# Altium project Inverter_Power.PrjPcb (part 1 of 3)
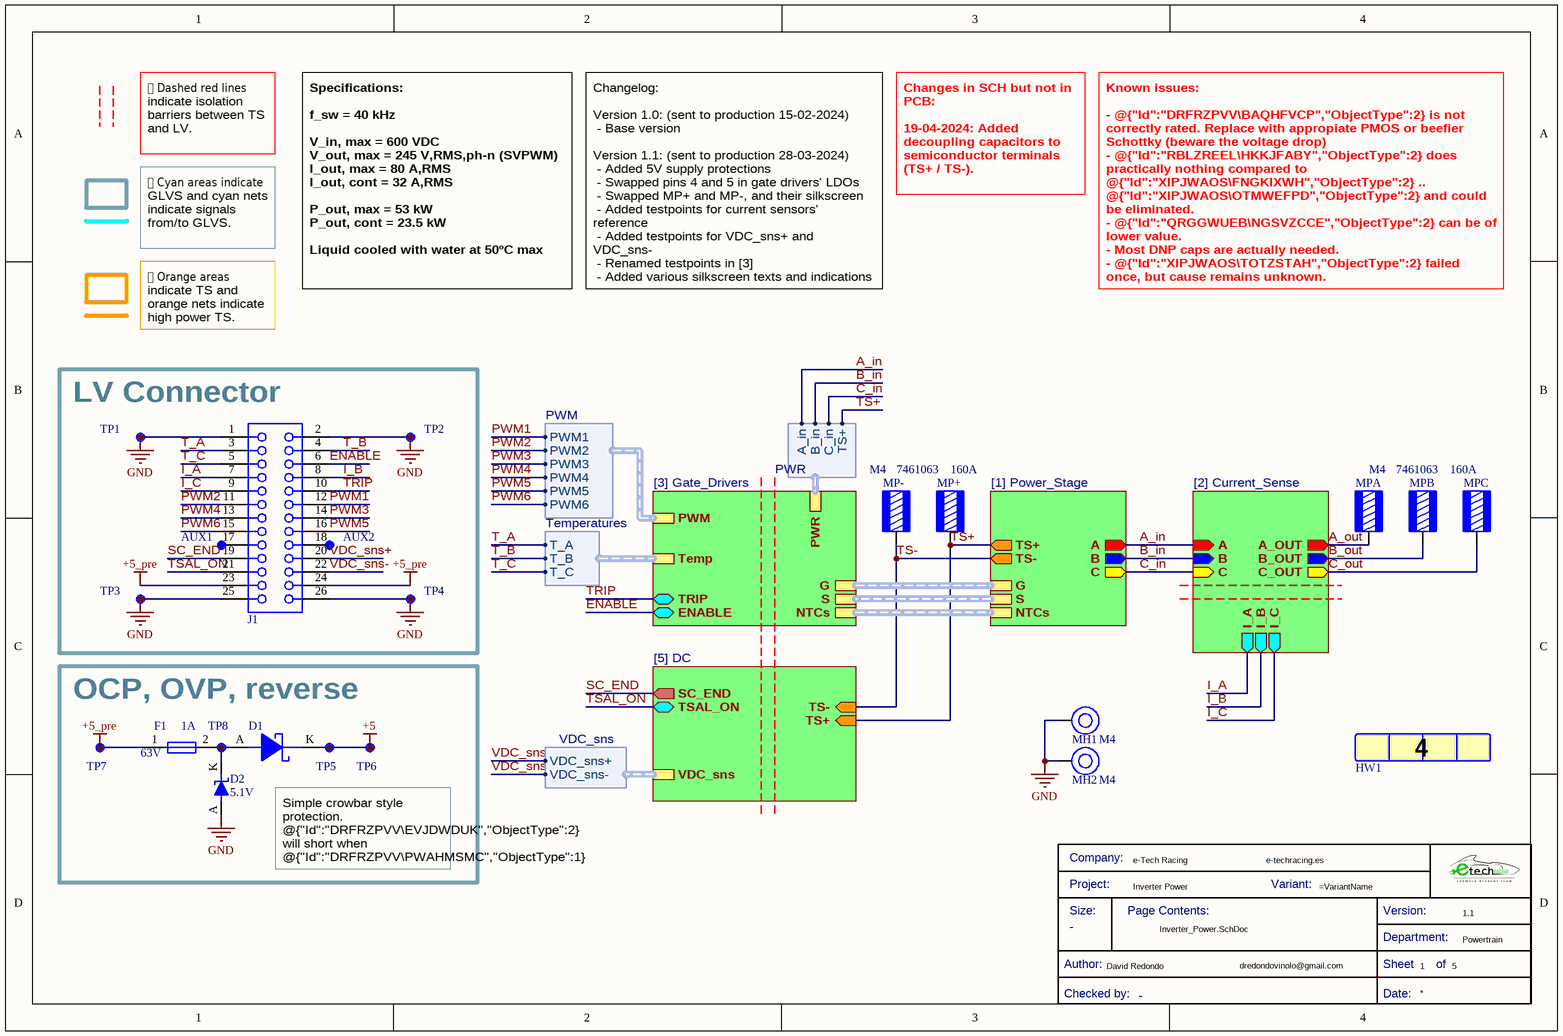
[diagram p0: Inverter_Power.SchDoc]
Company: e-Tech Racing; Department: Powertrain; DesignedByURL: e-techracing.es; DesignerMail: dredondovinolo@gmail.com; DesignerName: David Redondo; Project: Inverter Power; ReviewerName: -; Version: 1.1
6 sheets, 317 parts. Net scope: hierarchical (ports join the sheet entries above them; power ports are global).
Board file: Inverter_Power.PcbDoc
Sheets:
  Inverter_Power.SchDoc
    Power_Stage = [1] Power_Stage.SchDoc
    Current_Sense = [2] Current_Sense.SchDoc
    Gate_Drivers = [3] Gate_Drivers.SchDoc
      A = [4] Half_Bridge.SchDoc
      B = [4] Half_Bridge.SchDoc
      C = [4] Half_Bridge.SchDoc
    DC = [5] DC.SchDoc

## Sheet Inverter_Power.SchDoc
size A4; SheetNumber: 1; SheetTotal: 5

### Parts
*  Title Block_template  (value not drawn)  (graphical)
AUX1  TestPoint  [TestPoint]  (value not drawn)  (no BOM)
AUX2  TestPoint  [TestPoint]  (value not drawn)  (no BOM)
D1  MBR0530  [DSC-SOD123]  (value not drawn)
D2  Reference Voltage-Nom: 5.1V  [DZ-6.2V-DO-214AC]  (hidden comment: BZG05C5V1-E3-TR)
F1  Current Rating: 1A  Voltage Rating (DC): 63V  [Fuse_1206]  (hidden comment: 0437001.WRA)
HW1  LOGO CAPAS (4)  [LOGO_LAYERS_4]  (value not drawn)
J1  613026243121  [613026243121]  (value not drawn)
MH1  Mounting_Hole_M4  [Mounting_Hole_M4]  (value not drawn)
MH2  Mounting_Hole_M4  [Mounting_Hole_M4]  (value not drawn)
MP+  M4  [7461063_HAL]  (value not drawn)
MP-  Rated Current: 160A  [7461063_HAL]  (hidden comment: M4)
MPA  M4  [7461063_HAL]  (value not drawn)
MPB  Rated Current: 160A  [7461063_HAL]  (hidden comment: M4)
MPC  M4  [7461063_HAL]  (value not drawn)
TP1  TestPoint  [TestPoint]  (value not drawn)  (no BOM)
TP2  TestPoint  [TestPoint]  (value not drawn)  (no BOM)
TP3  TestPoint  [TestPoint]  (value not drawn)  (no BOM)
TP4  TestPoint  [TestPoint]  (value not drawn)  (no BOM)
TP5  TestPoint  [TestPoint]  (value not drawn)  (no BOM)
TP6  TestPoint  [TestPoint]  (value not drawn)  (no BOM)
TP7  TestPoint  [TestPoint]  (value not drawn)  (no BOM)
TP8  TestPoint  [TestPoint]  (value not drawn)  (no BOM)

### Blocks framed on the sheet
LV Connector: AUX1 AUX2 J1 TP1-TP4
OCP, OVP, reverse: D1 D2 F1 TP5-TP8

### Sub-sheets
Current_Sense = [2] Current_Sense: A (in), B (in), C (in), A_OUT (out), B_OUT (out), C_OUT (out), I_B (out), I_A (out), I_C (out)
DC = [5] DC: TS+ (in), TS- (in), VDC_sns (harness VDC_sns), TSAL_ON (bidir), SC_END (out)
Gate_Drivers = [3] Gate_Drivers: ENABLE (bidir), S (harness S), G (harness G), PWM (harness PWM), NTCs (harness NTCs), Temp (harness Temperatures), TRIP (bidir), PWR (harness PWR)
Power_Stage = [1] Power_Stage: A (out), B (out), C (out), TS+ (out), TS- (out), NTCs (harness NTCs), S (harness S), G (harness G)

### Harnesses
PWM: PWM1, PWM2, PWM3, PWM4, PWM5, PWM6
Temperatures: T_A, T_B, T_C
PWR: A_in, B_in, C_in, TS+
VDC_sns: VDC_sns+, VDC_sns-

### Nets
+5: D1.K TP5.1(TP) TP6.1(TP)
+5_pre: F1.1 J1.23 J1.24 TP7.1(TP)
A_in: sheet Power_Stage/A, sheet Current_Sense/A, sheet Gate_Drivers/PWR.A_in
B_in: sheet Power_Stage/B, sheet Current_Sense/B, sheet Gate_Drivers/PWR.B_in
C_in: sheet Power_Stage/C, sheet Current_Sense/C, sheet Gate_Drivers/PWR.C_in
GND: D2.A J1.1 J1.2 J1.25 J1.26 MH1.1 MH2.1 TP1.1(TP) TP2.1(TP) TP3.1(TP) TP4.1(TP)
TS+: MP+.1 ; sheet Power_Stage/TS+, sheet DC/TS+, sheet Gate_Drivers/PWR.TS+
TS-: MP-.1 ; sheet Power_Stage/TS-, sheet DC/TS-
A_out: MPA.1 ; sheet Current_Sense/A_OUT
B_out: MPB.1 ; sheet Current_Sense/B_OUT
C_out: MPC.1 ; sheet Current_Sense/C_OUT
ENABLE: J1.6 ; sheet Gate_Drivers/ENABLE
I_A: J1.7 ; sheet Current_Sense/I_A
I_B: J1.8 ; sheet Current_Sense/I_B
I_C: J1.9 ; sheet Current_Sense/I_C
PWM1: J1.12 ; sheet Gate_Drivers/PWM.PWM1
PWM2: J1.11 ; sheet Gate_Drivers/PWM.PWM2
PWM3: J1.14 ; sheet Gate_Drivers/PWM.PWM3
PWM4: J1.13 ; sheet Gate_Drivers/PWM.PWM4
PWM5: J1.16 ; sheet Gate_Drivers/PWM.PWM5
PWM6: J1.15 ; sheet Gate_Drivers/PWM.PWM6
SC_END: J1.19 ; sheet DC/SC_END
T_A: J1.3 ; sheet Gate_Drivers/Temp.T_A
T_B: J1.4 ; sheet Gate_Drivers/Temp.T_B
T_C: J1.5 ; sheet Gate_Drivers/Temp.T_C
TRIP: J1.10 ; sheet Gate_Drivers/TRIP
TSAL_ON: J1.21 ; sheet DC/TSAL_ON
VDC_sns+: J1.20 ; sheet DC/VDC_sns.VDC_sns+
VDC_sns-: J1.22 ; sheet DC/VDC_sns.VDC_sns-
NetAUX1_1: AUX1.1(TP) J1.17
NetAUX2_1: AUX2.1(TP) J1.18
NetD1_A: D1.A D2.K F1.2 TP8.1(TP)

### Buses and harness runs
harness sheet Gate_Drivers/G = sheet Power_Stage/G
harness sheet Gate_Drivers/NTCs = sheet Power_Stage/NTCs
harness sheet Gate_Drivers/S = sheet Power_Stage/S

### Notes on the sheet
- ⓘ Dashed red lines indicate isolation barriers between TS and LV.
- ⓘ Cyan areas indicate GLVS and cyan nets indicate signals from/to GLVS.
- Changes in SCH but not in PCB:
  19-04-2024: Added decoupling capacitors to semiconductor terminals (TS+ / TS-).
- Specifications:
  f_sw = 40 kHz
  V_in, max = 600 VDC
  V_out, max = 245 V,RMS,ph-n (SVPWM)
  I_out, max = 80 A,RMS
  I_out, cont = 32 A,RMS
  P_out, max = 53 kW
  P_out, cont = 23.5 kW
  Liquid cooled with water at 50ºC max
- Changelog:
  Version 1.0: (sent to production 15-02-2024)
  - Base version
  Version 1.1: (sent to production 28-03-2024)
  - Added 5V supply protections
  - Swapped pins 4 and 5 in gate drivers' LDOs
  - Swapped MP+ and MP-, and their silkscreen
  - Added testpoints for current sensors' reference
  - Added testpoints for VDC_sns+ and VDC_sns-
  - Renamed testpoints in [3]
  - Added various silkscreen texts and indications
  - Added layer physical logo
- Known issues:
  - @{"Id":"DRFRZPVV\BAQHFVCP","ObjectType":2} is not correctly rated. Replace with appropiate PMOS or beefier Schottky (beware the voltage drop)
  - @{"Id":"RBLZREEL\HKKJFABY","ObjectType":2} does practically nothing compared to @{"Id":"XIPJWAOS\FNGKIXWH","ObjectType":2} .. @{"Id":"XIPJWAOS\OTMWEFPD","ObjectType":2} and could be eliminated.
  - @{"Id":"QRGGWUEB\NGSVZCCE","ObjectType":2} can be of lower value.
  - Most DNP caps are actually needed.
  - @{"Id":"XIPJWAOS\TOTZSTAH","ObjectType":2} failed once, but cause remains unknown.
  - @{"Id":"XIPJWAOS\BERXNCAD","ObjectType":2} should have a bigger value.
  - @{"Id":"XIPJWAOS\TLMWNZGJ","ObjectType":2} and @{"Id":"XIPJWAOS\ETFZDMYQ","ObjectType":2} should have a small tolerance, and it should be specified in the schematic.
  - 10uF 50V 0805 caps are expensive and should be replaced with 10uF 50V 1206 or 10uF 50V 1210.
- ⓘ Orange areas indicate TS and orange nets indicate high power TS.
- M4
- (near MH2) M4
- Simple crowbar style protection. @{"Id":"DRFRZPVV\EVJDWDUK","ObjectType":2} will short when @{"Id":"DRFRZPVV\PWAHMSMC","ObjectType":1} > 5.1V, and it will cause the fuse to blow.
- (in symbol LOGO CAPAS) 4 Layers
- (in symbol Title Block_template) Company:; Project:; Variant:; Size:; Page Contents:; Version:; Department:; Author:; Sheet; of; Checked by:; Date:

### Library data of the parts
* = Title Block_template: Standard Title Block; .Creator: GP; Category: Title Block; .PCBcheck: GP; .SCHcheck: GP; Checked by:: -; Size: -
AUX1 AUX2 TP1-TP8 = TestPoint: Test Point 1x1 mm; .Creator: GP; Category: TestPoint; .PCBcheck: GP; .SCHcheck: GP
D1 = DSC-0.5/30-SOD123: VR=30V IF=500mA 30pF P=410mW; Element Configuration: Single; Forward Voltage: 430mV; Peak Non-Repetitive Surge Current: 5.5A; Average Rectified Current: 500mA; Max Reverse Leakage Current: 130uA; Max Reverse Voltage (DC): 30V; Polarity: Standard; .Creator: GP; Category: Diode; ComponentLink1Description: Datasheet; ComponentLink1URL: *; ComponentLink2Description: Where buy it; ComponentLink2URL: *; Supplier 1: Newark; Stock 1: 9; Pricing 1: 1=0,34400, 10=0,23900, 100=0,12200, 500=0,10000 (USD); Mount: Surface Mount; Contact Plating: Tin,Matte; Weight: 0.03g; Package Quantity: 1; Max Surge Current: 5.5A; Forward Current: 500mA; Max Reverse Current: 130uA; Max Repetitive Reverse Voltage (Vrrm): 30V; Max Forward Surge Current (Ifsm): 5.5A; Voltage Rating (DC): 30V; Current Rating: 500mA; Output Current: 500mA; Series: -; Length: 2.7mm; Width: 1.6mm; Height: 1.03mm; Radiation Hardening: No; RoHS Compliant: Yes; REACH SVHC: No SVHC; Lead Free: Lead Free; ComponentLink3URL: https://datasheet.ciiva.com/30479/0900766b810e2512-30479401.pdf?src-supplier=RSComponents; ComponentLink3Description: https://datasheet.ciiva.com/30479/0900766b810e2512-30479401.pdf?src-supplier=RSComponents; ComponentLink4URL: https://datasheet.ciiva.com/34301/974753-34301826.pdf?src-supplier=Jameco; ComponentLink4Description: https://datasheet.ciiva.com/34301/974753-34301826.pdf?src-supplier=Jameco; ComponentLink5URL: https://datasheet.ciiva.com/910/mbr0530-910516.pdf?src-supplier=Digi-Key; ComponentLink5Description: https://datasheet.ciiva.com/910/mbr0530-910516.pdf?src-supplier=Digi-Key; ComponentLink6URL: https://datasheet.ciiva.com/25931/mbr0530-25931989.pdf?src-supplier=Avnet+Europe; ComponentLink6Description: https://datasheet.ciiva.com/25931/mbr0530-25931989.pdf?src-supplier=Avnet+Europe; ComponentLink7URL: https://datasheet.ciiva.com/8300/mbr0530-8300905.pdf?src-supplier=Avnet; ComponentLink7Description: https://datasheet.ciiva.com/8300/mbr0530-8300905.pdf?src-supplier=Avnet; ComponentLink8URL: https://datasheet.ciiva.com/17318/mbr0530-17318568.pdf?src-supplier=Future+Electronics; ComponentLink8Description: https://datasheet.ciiva.com/17318/mbr0530-17318568.pdf?src-supplier=Future+Electronics; ComponentLink9URL: https://datasheet.ciiva.com/15144/getdatasheetpartid-86760-15144598.pdf?src-supplier=Verical; ComponentLink9Description: https://datasheet.ciiva.com/15144/getdatasheetpartid-86760-15144598.pdf?src-supplier=Verical; ComponentLink10URL: https://datasheet.ciiva.com/910/mbr0530-910518.pdf?src-supplier=Digi-Key; ComponentLink10Description: https://datasheet.ciiva.com/910/mbr0530-910518.pdf?src-supplier=Digi-Key; Supplier Part Number 1: 15R3453
D2 = DZ-5.1V-DO-214AC: Zener Diode, 5.1V V(Z), 5.88%, 1.25W, Silicon, Unidirectional, DO-214AC; Manufacturer: Vishay; Manufacturer Part Number: BZG05C5V1-M3-08; Package Body Material: Plastic; Additional Feature: HIGH RELIABILITY; Number of Elements: 1; Test Current: 45mA; Time @ Peak Reflow Temperature-Max (s): 30s; Supplier: Mouser; Supplier Part Number: 78-BZG05C5V1-M3-08; RoHS: Yes; Category: Zener Diodes; Stock: 28077; Pricing: 1=0,38, 10=0,3, 50=0,3, 100=0,179, 1000=0,113, 10000=0,089 (USD); Pins: 2; Diode Element Material: SILICON; Package Shape: Rectangular; Terminal Finish: Tin; Max Operating Temperature: 150°C; JESD-609 Code: e3; Polarity: Unidirectional; Diode Type: ZENER; JESD-30 Code: R-PDSO-C2; Moisture Sensitivity Level: 1; Package Style: SMALL OUTLINEMeter; Peak Reflow Temperature (Cel): 260°C; Max Power Dissipation: 1.25W; Surface Mount: Yes; Technology: ZENER; Terminal Form: C BEND; Terminal Position: DUAL; Voltage Tol-Max: 5.88%; JEDEC-95 Code: DO-214AC; RoHS Compliant: Yes; Reach SVHC Compliant: No; ComponentLink1URL: https://datasheet.ciiva.com:443/pdfs/VipMasterIC/IC/VISH/VISH-S-A0008998108/VISH-S-A0008998108-1.pdf?src-supplier=IHS+Markit; ComponentLink1Description: https://datasheet.ciiva.com:443/pdfs/VipMasterIC/IC/VISH/VISH-S-A0008998108/VISH-S-A0008998108-1.pdf?src-supplier=IHS+Markit; ComponentLink2URL: http://www.vishay.com/docs/86135/bzg05c-m-series.pdf?src-supplier=Digikey; ComponentLink2Description: http://www.vishay.com/docs/86135/bzg05c-m-series.pdf?src-supplier=Digikey
F1 = Fuse_1A_63V_1206: Fuse Chip Fast Acting 1A 63V SMD Solder Pad 1206 Ceramic T/R Automotive; Manufacturer: Littelfuse; Fuse Type: Board Mount (Cartridge Style Excluded); Approvals: CSA,cURus; .Creator: DO; Supplier 1: Digi-Key; Manufacturer Part Number: 0437001.WRA; RoHS: Yes; Category: Fuses; Stock 1: 5820; Pricing 1: 1=1,52000, 5=1,47000, 10=1,37600, 50=1,13860, 100=0,94880, 250=0,92508, 500=0,78276, 1000=0,68788 (USD); Mount: Surface Mount; Case/Package: 1206; Case Code (Imperial): 1206; Case Code (Metric): 3216; Min Operating Temperature: -55°C; Max Operating Temperature: 150°C; Packaging: Tape and Reel; Voltage Rating (AC): 63V; ComponentLink1URL: https://www.littelfuse.com/~/media/electronics/datasheets/fuses/littelfuse_fuse_437a_datasheet.pdf.pdf?src-supplier=Digi-Key; ComponentLink1Description: https://www.littelfuse.com/~/media/electronics/datasheets/fuses/littelfuse_fuse_437a_datasheet.pdf.pdf?src-supplier=Digi-Key; Supplier Part Number 1: F10001CT-ND; ComponentLink2Description: Where buy it; ComponentLink2URL: https://www.mouser.es/ProductDetail/Littelfuse/0437001WRA?qs=DXv0QSHKF4z9CJhPXjxR%252BA%3D%3D
HW1 = LOGO CAPAS: Logo 4 capas; Id: 0074; Observations: Layers; Checked: False; Type: Logos; Supplier 1: Farnell; Supplier 2: Mouser; Supplier 3: RS; Supplier 4: Digi-Key; Author: Enric; Date: 22/06/2012
J1 = 613026243121: WR-PHD Socket Header, THT, Angled, pitch 2.54mm, 2 Row, 26P; Manufacturer: Wurth Elektronik; Contact Resistance: 20mΩ; Rated Current: 3A; Working Voltage: 250V; Withstanding Voltage: 500V; ComponentLink1Description: Website Link; ComponentLink1URL: https://www.we-online.com/redexpert/article/613026243121?ad; ComponentLink2Description: Datasheet Link; ComponentLink2URL: https://www.we-online.com/redexpert/spec/613026243121?ad; Manufacturer Part Number: 613026243121; Category: Board-to-Board Connectors; Match Code: WR-PHD; Mount: Through Hole; Operating Temperature Max: 125°C; Operating Temperature Min: -40°C; Packaging: Tray; Gender: Socket Header; Number of Pins: 26; Number of Rows: 2; Orientation: Angled; Pitch: 2.54mm
MP+ MP- MPA MPB MPC = 7461063: WP-RATR REDCUBE PRESS-FIT right angled, two-rows, L9W9H14mm, M4, 160A; Manufacturer: Wurth Elektronik; Surface: Tin; ComponentLink1Description: Website Link; ComponentLink1URL: https://www.we-online.com/redexpert/article/7461063?ad; ComponentLink2Description: Datasheet Link; ComponentLink2URL: https://www.we-online.com/redexpert/spec/7461063?ad; Manufacturer Part Number: 7461063; Category: REDCUBE PRESS-FIT; Match Code: WP-RATR; Mount: Press Fit; Operating Temperature Max: 150°C; Operating Temperature Min: -55°C; Packaging: Bulk; Length: 9mm; Width: 9mm; Height: 14mm; Material: Brass; Number of Pins: 8; Thread Size: M4
  MP+ MPA MPC: Rated Current: 160A

## Sheet [1] Power_Stage.SchDoc
size A4; SheetNumber: 2; SheetTotal: 5
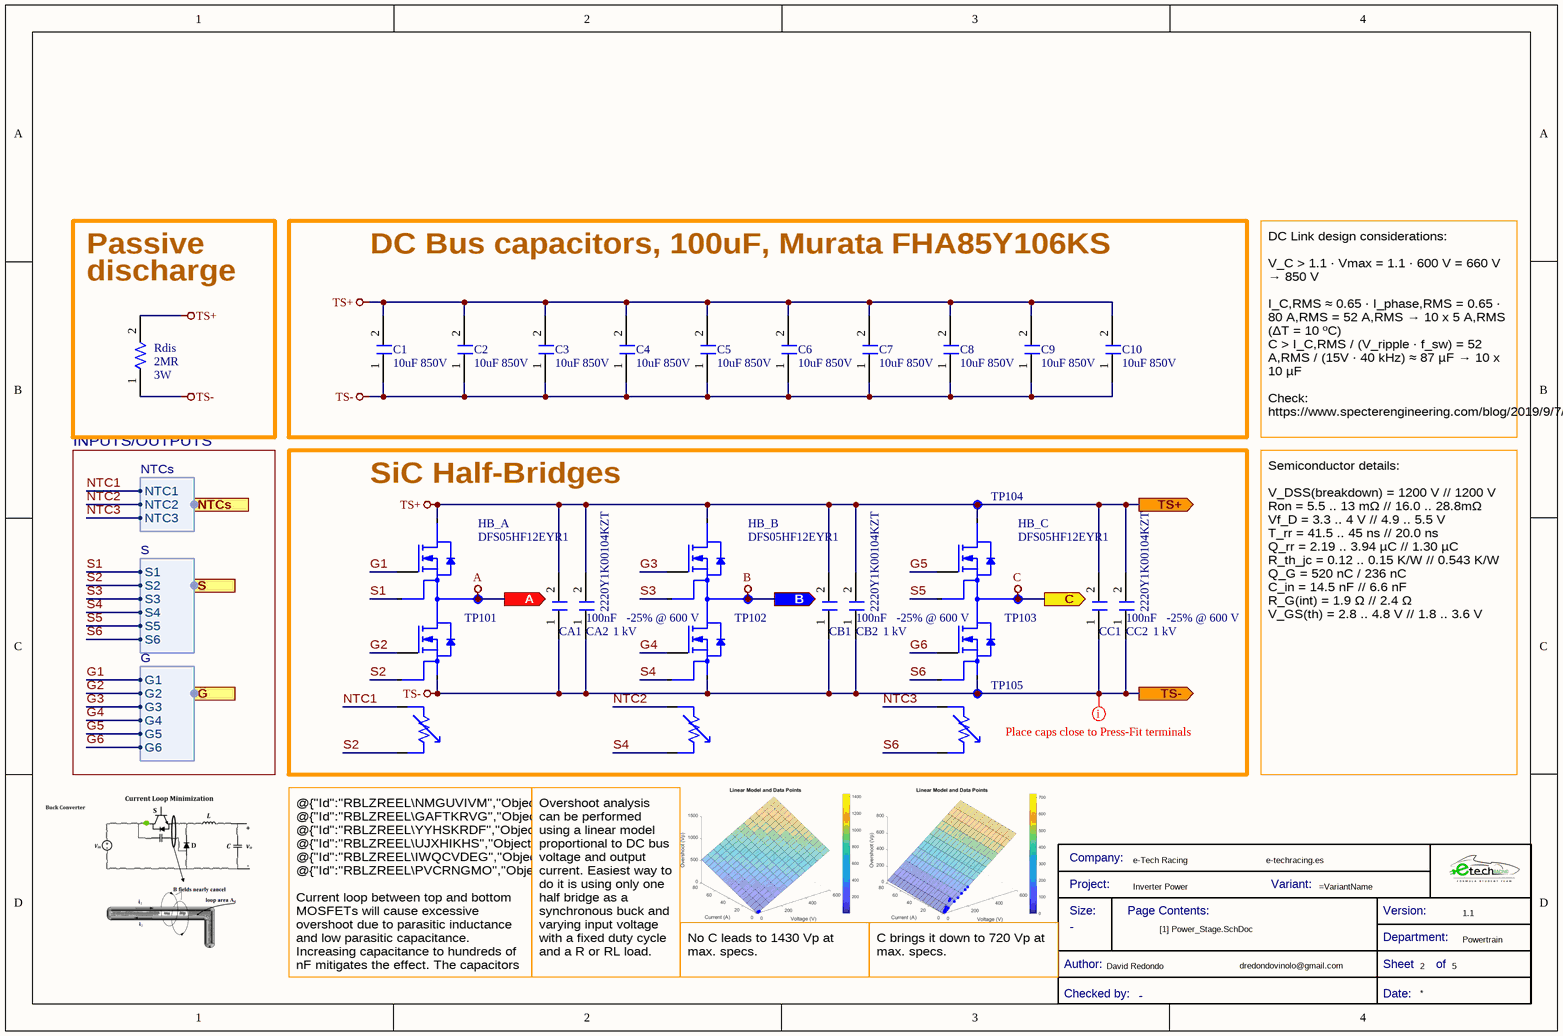
[diagram p1: [1] Power_Stage.SchDoc]

### Parts
(Parts that share a designator on the sheet are numbered #1, #2 ... from top to bottom, then left to right.)
*?#1  Title Block_template  (value not drawn)  (graphical)
C1  10uF 850V  [FHA85Y106KS]
C2  10uF 850V  [FHA85Y106KS]
C3  10uF 850V  [FHA85Y106KS]
C4  10uF 850V  [FHA85Y106KS]
C5  10uF 850V  [FHA85Y106KS]
C6  10uF 850V  [FHA85Y106KS]
C7  10uF 850V  [FHA85Y106KS]
C8  10uF 850V  [FHA85Y106KS]
C9  10uF 850V  [FHA85Y106KS]
C10  10uF 850V  [FHA85Y106KS]
CA1  2220Y1K00104KZT  [CAP_2220]  (value not drawn)
CA2  2220Y1K00104KZT  value 100nF  DC bias: -25% @ 600 V  Voltage rating: 1 kV  [CAP_2220]
CB1  2220Y1K00104KZT  [CAP_2220]  (value not drawn)
CB2  2220Y1K00104KZT  value 100nF  DC bias: -25% @ 600 V  Voltage rating: 1 kV  [CAP_2220]
CC1  2220Y1K00104KZT  [CAP_2220]  (value not drawn)
CC2  2220Y1K00104KZT  value 100nF  DC bias: -25% @ 600 V  Voltage rating: 1 kV  [CAP_2220]
HB_A  DFS05HF12EYR1  [DFS05HF12EYR1]
HB_B  DFS05HF12EYR1  [DFS05HF12EYR1]
HB_C  DFS05HF12EYR1  [DFS05HF12EYR1]
Rdis  Power Rating: 3W  Resistance: 2MR  [R2512FTK]  (hidden comment: R2M-2512FTK)
TP101  TestPoint  [TestPoint]  (value not drawn)  (no BOM)
TP102  TestPoint  [TestPoint]  (value not drawn)  (no BOM)
TP103  TestPoint  [TestPoint]  (value not drawn)  (no BOM)
TP104  TestPoint  [TestPoint]  (value not drawn)  (no BOM)
TP105  TestPoint  [TestPoint]  (value not drawn)  (no BOM)

### Blocks framed on the sheet
DC Bus capacitors, 100uF, Murata FHA85Y106KS: C1-C10
SiC Half-Bridges: CA1 CA2 CB1 CB2 CC1 CC2 HB_A HB_B HB_C TP101-TP105

### Ports
A (out, see Inverter_Power[3C], [2] Current_Sense[2A]), B (out, see Inverter_Power[3C], [2] Current_Sense[2B]), C (out, see Inverter_Power[3C], [2] Current_Sense[2C]), G (harness G, see Inverter_Power[3C], [3] Gate_Drivers[3A]), NTCs (harness NTCs, see Inverter_Power[3C], [3] Gate_Drivers[4A]), S (harness S, see Inverter_Power[3C], [3] Gate_Drivers[3A]), TS+ (out, see Inverter_Power[3C], [4] Half_Bridge[3A], [5] DC[1D]), TS- (out, see Inverter_Power[3C], [5] DC[1D])

### Harnesses
NTCs: NTC1, NTC2, NTC3
S: S1, S2, S3, S4, S5, S6
G: G1, G2, G3, G4, G5, G6

### Nets
A: HB_A.1(AC) TP101.1(TP) ; port A  [project net A_in]
B: HB_B.1(AC) TP102.1(TP) ; port B  [project net B_in]
C: HB_C.1(AC) TP103.1(TP) ; port C  [project net C_in]
TS+: C1.2 C2.2 C3.2 C4.2 C5.2 C6.2 C7.2 C8.2 C9.2 C10.2 CA1.2 CA2.2 CB1.2 CB2.2 CC1.2 CC2.2 HB_A.4(DC+) HB_B.4(DC+) HB_C.4(DC+) Rdis.2 TP104.1(TP) ; port TS+
TS-: C1.1 C2.1 C3.1 C4.1 C5.1 C6.1 C7.1 C8.1 C9.1 C10.1 CA1.1 CA2.1 CB1.1 CB2.1 CC1.1 CC2.1 HB_A.5(DC-) HB_B.5(DC-) HB_C.5(DC-) Rdis.1 TP105.1(TP) ; port TS-
G1: HB_A.6(G1) ; port G.G1
G2: HB_A.3(G2) ; port G.G2
G3: HB_B.6(G1) ; port G.G3
G4: HB_B.3(G2) ; port G.G4
G5: HB_C.6(G1) ; port G.G5
G6: HB_C.3(G2) ; port G.G6
NTC1: HB_A.9(T2) ; port NTCs.NTC1
NTC2: HB_B.9(T2) ; port NTCs.NTC2
NTC3: HB_C.9(T2) ; port NTCs.NTC3
S1: HB_A.7(S1) ; port S.S1
S2: HB_A.2(S2) HB_A.8(T1) ; port S.S2
S3: HB_B.7(S1) ; port S.S3
S4: HB_B.2(S2) HB_B.8(T1) ; port S.S4
S5: HB_C.7(S1) ; port S.S5
S6: HB_C.2(S2) HB_C.8(T1) ; port S.S6

### Layout directives
mark named Place caps close to Press-Fit terminals: TS-

### Notes on the sheet
- Passive
- discharge
- INPUTS/OUTPUTS
- DC Link design considerations:
  V_C > 1.1 · Vmax = 1.1 · 600 V = 660 V → 850 V
  I_C,RMS ≈ 0.65 · I_phase,RMS = 0.65 · 80 A,RMS = 52 A,RMS → 10 x 5 A,RMS (ΔT = 10 ºC)
  C > I_C,RMS / (V_ripple · f_sw) = 52 A,RMS / (15V · 40 kHz) ≈ 87 µF → 10 x 10 µF
  Check: https://www.specterengineering.com/blog/2019/9/7/dc-link-capacitor-selection-for-your-inverter
- Semiconductor details:
  V_DSS(breakdown) = 1200 V // 1200 V
  Ron = 5.5 .. 13 mΩ // 16.0 .. 28.8mΩ
  Vf_D = 3.3 .. 4 V // 4.9 .. 5.5 V
  T_rr = 41.5 .. 45 ns // 20.0 ns
  Q_rr = 2.19 .. 3.94 µC // 1.30 µC
  R_th_jc = 0.12 .. 0.15 K/W // 0.543 K/W
  Q_G = 520 nC / 236 nC
  C_in = 14.5 nF // 6.6 nF
  R_G(int) = 1.9 Ω // 2.4 Ω
  V_GS(th) = 2.8 .. 4.8 V // 1.8 .. 3.6 V
- (near HB_A) @{"Id":"RBLZREEL\NMGUVIVM","ObjectType":2}, @{"Id":"RBLZREEL\GAFTKRVG","ObjectType":2}, @{"Id":"RBLZREEL\YYHSKRDF","ObjectType":2}, @{"Id":"RBLZREEL\UJXHIKHS","ObjectType":2}, @{"Id":"RBLZREEL\IWQCVDEG","ObjectType":2}, @{"Id":"RBLZREEL\PVCRNGMO","ObjectType":2}
  Current loop between top and bottom MOSFETs will cause excessive overshoot due to parasitic inductance and low parasitic capacitance. Increasing capacitance to hundreds of nF mitigates the effect. The capacitors essentially work as a switching decoupling. MLCCs with low DC bias or film, but MLCCs are way more compact. Place as close as possible to semiconductor terminals.
- (near HB_B) Overshoot analysis can be performed using a linear model proportional to DC bus voltage and output current. Easiest way to do it is using only one half bridge as a synchronous buck and varying input voltage with a fixed duty cycle and a R or RL load.
- No C leads to 1430 Vp at max. specs.
- (near *?#1) C brings it down to 720 Vp at max. specs.
- (in symbol Title Block_template) Company:; Project:; Variant:; Size:; Page Contents:; Version:; Department:; Author:; Sheet; of; Checked by:; Date:

### Library data of the parts
*?#1 = Title Block_template: Standard Title Block; .Creator: GP; Category: Title Block; .PCBcheck: GP; .SCHcheck: GP; Checked by:: -; Size: -
C1-C10 = FHA85Y106KS: High Temperature Film Capacitor for Automotive Application
CA1 CB1 CC1 = 2220Y1K00104KZT: 100NF 2220 Case Size 1000V Ceram; Manufacturer: Knowles Syfer; DC bias: -25% @ 600 V; Voltage rating: 1 kV; Footprint: 2220; Supplier: Digikey; Supplier Part Number: 1608-2220Y1K00104KZTCT-ND; RoHS: No; Category: Ceramic Capacitors; Stock: 650; Pricing: 1=5,53, 10=4,753, 50=4,3112, 100=3,5595 (USD); Manufacturer Part Number: 2220Y1K00104KZT; Value: 100nF
CA2 CB2 CC2 = 2220Y1K00104KZT: 100NF 2220 Case Size 1000V Ceram; Manufacturer: Knowles Syfer; Footprint: 2220; Supplier: Digikey; Supplier Part Number: 1608-2220Y1K00104KZTCT-ND; RoHS: No; Category: Ceramic Capacitors; Stock: 650; Pricing: 1=5,53, 10=4,753, 50=4,3112, 100=3,5595 (USD); Manufacturer Part Number: 2220Y1K00104KZT
HB_A HB_B HB_C = DFS05HF12EYR1: 1200V/5.5mΩ Half Bridge SiC MOSFET Module; Blocking voltage: 1200 V; Rds(on): 5.5 mOhm .. 13 mOhm; Maximum junction temperature: 175 °C; Isolation voltage: 3.4 kV; Maximum VGSS: +21 V / -2 V; Maximum IDS-ISD: 150 A; NTC resistance @25 ºC: 5 kOhm; NTC B-value @50 ºC: 3375 K; VGS(th): 2.8 V .. 4.8 V; QG: 520 nC; RGint: 1.9 Ohm; Rth(j-c): 0.12 K/W; Vf_diode: 3.3 V .. 4.0 V; ComponentLink1Description: Datasheet; ComponentLink1URL: https://www.leapers-power.com/action/download?file=/web/uploads/file/20230309/E66B0Y1w3x716fyKzgl84X9Kg38sCV40.pdf
Rdis = R2M-2512FTK: Current Sense Resistors - SMD 3watts .002ohms 1%; Manufacturer: Vishay Dale; Manufacturer Part Number: WSLP25122L000FEA; Temperature Coefficient: 275ppm/°C; Supplier 1: Mouser; RoHS: Yes; Category: Chip SMD Resistors; Stock 1: 11994; Pricing 1: 1=1,07000, 10=1,07000, 50=1,07000, 100=1,07000, 1000=0,77100, 10000=0,75500 (USD); Mount: Surface Mount; Case/Package: 2512; Case Code (Imperial): 2512; Case Code (Metric): 6432; Weight: 0.001429oz; Size Code: 2512; Min Operating Temperature: -65°C; Max Operating Temperature: 170°C; Tolerance: 1%; Packaging: Tape and Reel; Resistor Type: Metal Strip; Package Quantity: 2000; Termination: SMD/SMT; Series: WSLP; Length: 6.4mm; Width: 3.2mm; Height: 0.635mm; RoHS Compliant: Yes; Lead Free: Lead Free; ComponentLink1URL: https://datasheet.ciiva.com/48527/wslp-48527354.pdf?src-supplier=Avnet; ComponentLink1Description: https://datasheet.ciiva.com/48527/wslp-48527354.pdf?src-supplier=Avnet; Supplier Part Number 1: 71-WSLP25122L000FEA
TP101-TP105 = TestPoint: Test Point 1x1 mm; .Creator: GP; Category: TestPoint; .PCBcheck: GP; .SCHcheck: GP

## Sheet [2] Current_Sense.SchDoc
size A4; SheetNumber: 3; SheetTotal: 5
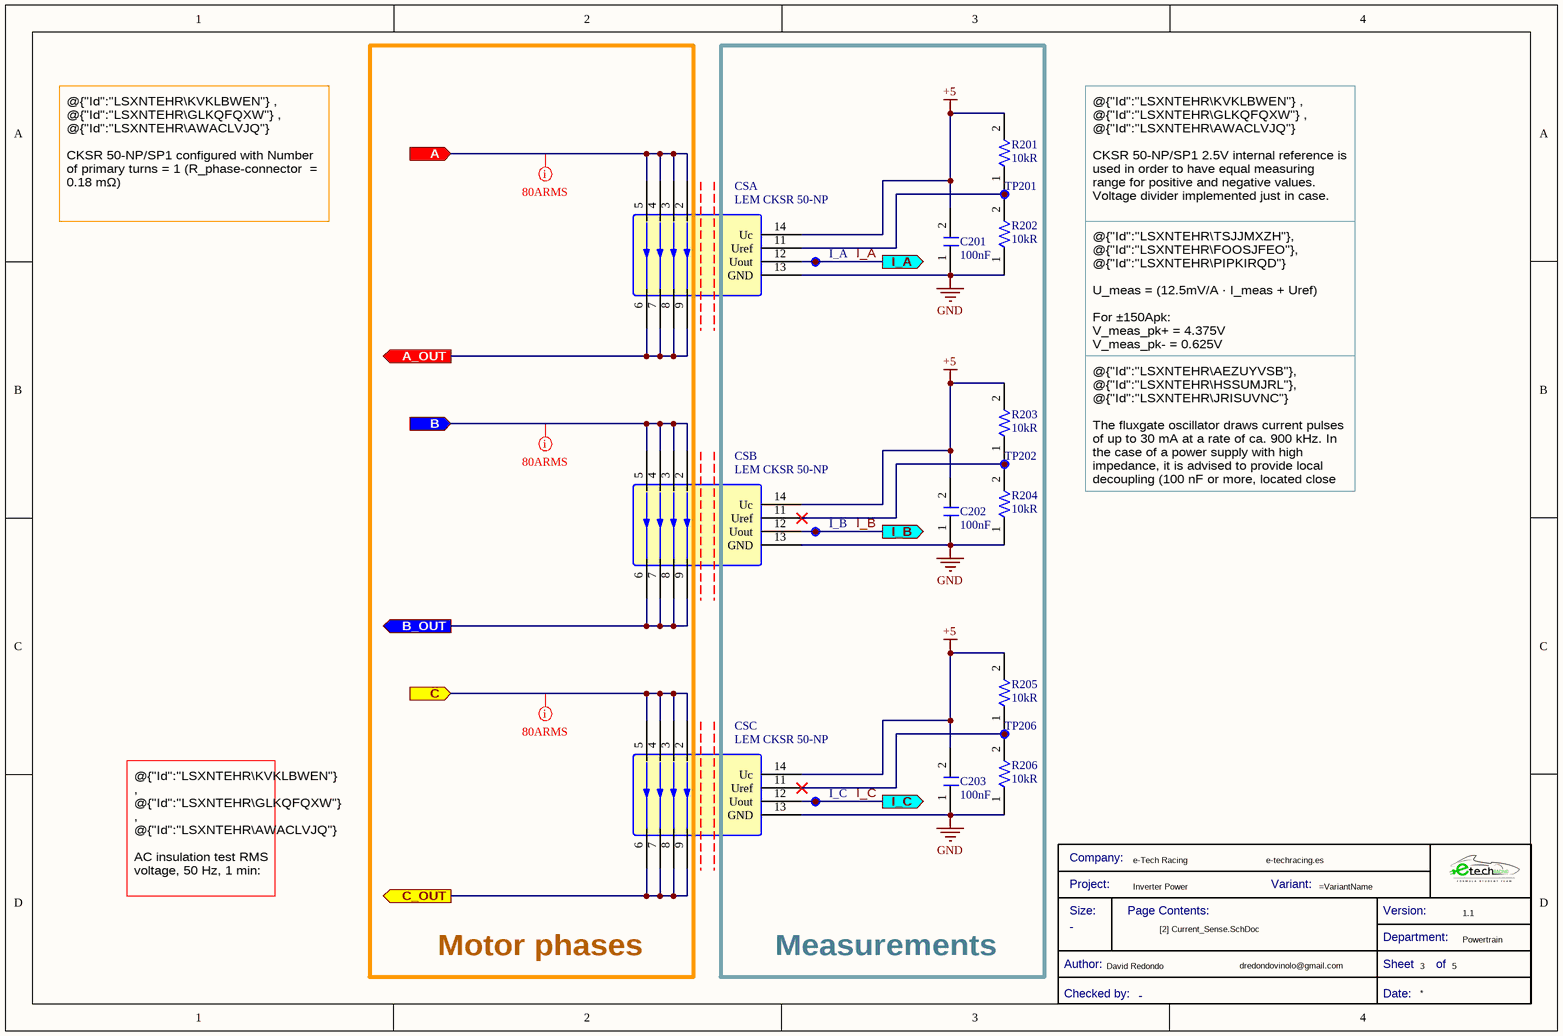
[diagram p2: [2] Current_Sense.SchDoc]

### Parts
(Parts that share a designator on the sheet are numbered #1, #2 ... from top to bottom, then left to right.)
*?#2  Title Block_template  (value not drawn)  (graphical)
C201  Capacitance: 100nF  [C0805FNPC-R]  (hidden comment: 885012207098)
C202  Capacitance: 100nF  [C0805FNPC-R]  (hidden comment: 885012207098)
C203  Capacitance: 100nF  [C0805FNPC-R]  (hidden comment: 885012207098)
CSA  LEM CKSR 50-NP  [CKSR 50-NP]
CSB  LEM CKSR 50-NP  [CKSR 50-NP]
CSC  LEM CKSR 50-NP  [CKSR 50-NP]
I_A  TestPoint  [TestPoint]  (value not drawn)  (no BOM)
I_B  TestPoint  [TestPoint]  (value not drawn)  (no BOM)
I_C  TestPoint  [TestPoint]  (value not drawn)  (no BOM)
R201  Resistance: 10kR  [R0805FTK]  (hidden comment: CR0805-JW-103ELF)
R202  Resistance: 10kR  [R0805FTK]  (hidden comment: CR0805-JW-103ELF)
R203  Resistance: 10kR  [R0805FTK]  (hidden comment: CR0805-JW-103ELF)
R204  Resistance: 10kR  [R0805FTK]  (hidden comment: CR0805-JW-103ELF)
R205  Resistance: 10kR  [R0805FTK]  (hidden comment: CR0805-JW-103ELF)
R206  Resistance: 10kR  [R0805FTK]  (hidden comment: CR0805-JW-103ELF)
TP201  TestPoint  [TestPoint]  (value not drawn)  (no BOM)
TP202  TestPoint  [TestPoint]  (value not drawn)  (no BOM)
TP206  TestPoint  [TestPoint]  (value not drawn)  (no BOM)

### Blocks framed on the sheet
Measurements: C201-C203 I_A I_B I_C R201-R206 TP201 TP202 TP206

### Ports
A (in, see Inverter_Power[4C], [1] Power_Stage[2C]), A_OUT (out, see Inverter_Power[4C]), B (in, see Inverter_Power[4C], [1] Power_Stage[2C]), B_OUT (out, see Inverter_Power[4C]), C (in, see Inverter_Power[4C], [1] Power_Stage[3C]), C_OUT (out, see Inverter_Power[4C]), I_A (out, see Inverter_Power[4C]), I_B (out, see Inverter_Power[4C]), I_C (out, see Inverter_Power[4C])

### Nets
+5: C201.2 C202.2 C203.2 CSA.14(Uc) CSB.14(Uc) CSC.14(Uc) R201.2 R203.2 R205.2
A_in: CSA.2 CSA.3 CSA.4 CSA.5 ; port A
B_in: CSB.2 CSB.3 CSB.4 CSB.5 ; port B
C_in: CSC.2 CSC.3 CSC.4 CSC.5 ; port C
GND: C201.1 C202.1 C203.1 CSA.13(GND) CSB.13(GND) CSC.13(GND) R202.1 R204.1 R206.1
A_out: CSA.6 CSA.7 CSA.8 CSA.9 ; port A_OUT
B_out: CSB.6 CSB.7 CSB.8 CSB.9 ; port B_OUT
C_out: CSC.6 CSC.7 CSC.8 CSC.9 ; port C_OUT
I_A: CSA.12(Uout) I_A.1(TP) ; port I_A
I_B: CSB.12(Uout) I_B.1(TP) ; port I_B
I_C: CSC.12(Uout) I_C.1(TP) ; port I_C
NetCSA_11: CSA.11(Uref) R201.1 R202.2 TP201.1(TP)
NetCSB_11: CSB.11(Uref) R203.1 R204.2 TP202.1(TP)
NetCSC_11: CSC.11(Uref) R205.1 R206.2 TP206.1(TP)

### Layout directives
mark named 80ARMS: A_in, B_in, C_in

### Notes on the sheet
- @{"Id":"LSXNTEHR\KVKLBWEN"} , @{"Id":"LSXNTEHR\GLKQFQXW"} , @{"Id":"LSXNTEHR\AWACLVJQ"}
  CKSR 50-NP/SP1 configured with Number of primary turns = 1 (R_phase-connector  = 0.18 mΩ)
- @{"Id":"LSXNTEHR\KVKLBWEN"} , @{"Id":"LSXNTEHR\GLKQFQXW"} , @{"Id":"LSXNTEHR\AWACLVJQ"}
  CKSR 50-NP/SP1 2.5V internal reference is used in order to have equal measuring range for positive and negative values. Voltage divider implemented just in case.
- @{"Id":"LSXNTEHR\TSJJMXZH"}, @{"Id":"LSXNTEHR\FOOSJFEO"}, @{"Id":"LSXNTEHR\PIPKIRQD"}
  U_meas = (12.5mV/A · I_meas + Uref)
  For ±150Apk:
  V_meas_pk+ = 4.375V
  V_meas_pk- = 0.625V
- @{"Id":"LSXNTEHR\AEZUYVSB"}, @{"Id":"LSXNTEHR\HSSUMJRL"}, @{"Id":"LSXNTEHR\JRISUVNC"}
  The fluxgate oscillator draws current pulses of up to 30 mA at a rate of ca. 900 kHz. In the case of a power supply with high impedance, it is advised to provide local decoupling (100 nF or more, located close to the transducer).
- @{"Id":"LSXNTEHR\KVKLBWEN"} , @{"Id":"LSXNTEHR\GLKQFQXW"} , @{"Id":"LSXNTEHR\AWACLVJQ"}
  AC insulation test RMS voltage, 50 Hz, 1 min:
  Ud = 4.3 kV > 3*V_max = 1.8 kV
- Motor phases
- (in symbol Title Block_template) Company:; Project:; Variant:; Size:; Page Contents:; Version:; Department:; Author:; Sheet; of; Checked by:; Date:

### Library data of the parts
*?#2 = Title Block_template: Standard Title Block; .Creator: GP; Category: Title Block; .PCBcheck: GP; .SCHcheck: GP; Checked by:: -; Size: -
C201-C203 = C100n-50V-0805FNPC-X7R: Cap, 0.1ΜF, 50V, 10%, X7R, 0805; Manufacturer 1: Wurth Electronics; .Creator: DR; Supplier 1: RSComponents; Manufacturer Part Number 1: 885012207098; RoHS: Yes; Category: Ceramic Capacitors; Stock 1: 8000; Pricing 1: 100=0,10200, 500=0,07100, 2000=0,06100 (GBP); Mount: Surface Mount; Case/Package: 0805; Case Code (Metric): 2012; Case Code (Imperial): 0805; Min Operating Temperature: -55°C; Max Operating Temperature: 125°C; Packaging: Cut Tape; Voltage Rating: 50V; Dielectric: X7R; Tolerance: 10%; Voltage Rating (DC): 50V; Length: 0.079inch; Width: 0.049inch; Thickness: 0.035inch; REACH SVHC: Unknown; RoHS Compliant: Yes; ComponentLink1URL: http://www.farnell.com/datasheets/1958498.pdf?src-supplier=Farnell; ComponentLink1Description: http://www.farnell.com/datasheets/1958498.pdf?src-supplier=Farnell; ComponentLink2URL: http://www.farnell.com/datasheets/1958498.pdf?src-supplier=Element14; ComponentLink2Description: http://www.farnell.com/datasheets/1958498.pdf?src-supplier=Element14; ComponentLink3URL: https://katalog.we-online.de/pbs/datasheet/885012207098.pdf?src-supplier=Digi-Key; ComponentLink3Description: https://katalog.we-online.de/pbs/datasheet/885012207098.pdf?src-supplier=Digi-Key; ComponentLink4URL: http://www.farnell.com/datasheets/1958498.pdf?src-supplier=Newark; ComponentLink4Description: http://www.farnell.com/datasheets/1958498.pdf?src-supplier=Newark; Supplier Part Number 1: 1813493
CSA CSB CSC = CKSR 50-NP: Sensor Current Flux 50A AC/DC; Supplier 1: Rs; Manufacturer 1: LEM; Manufacturer Part Number 1: CKSR50-NP; RoHS: Yes; Category: Current Sensors; Stock 1: 84; Pricing 1: 1=15,8, 5=15,33, 10=14,65 (EUR); ComponentLink1URL: https://datasheet.ciiva.com/2812/cksrseries-2812726.pdf?src-supplier=Digi-Key; ComponentLink1Description: https://datasheet.ciiva.com/2812/cksrseries-2812726.pdf?src-supplier=Digi-Key; ComponentLink2URL: https://datasheet.ciiva.com/7992/1639868-7992216.pdf?src-supplier=Element14; ComponentLink2Description: https://datasheet.ciiva.com/7992/1639868-7992216.pdf?src-supplier=Element14; Supplier Part Number 1: 6668214
I_A I_B I_C TP201 TP202 TP206 = TestPoint: Test Point 1x1 mm; .Creator: GP; Category: TestPoint; .PCBcheck: GP; .SCHcheck: GP
R201-R206 = R10k-0805FTK: BOURNS         CR0805-JW-103ELF            Surface Mount Chip Resistor, Thick Film, CR Series, 10 kohm, 125 mW,  5%, 150 V; Temperature Coefficient: 200ppm/°C; Power Rating: 125mW; Voltage Rating: 150V; Voltage Rating (DC): 100V; .Creator: DR; Supplier 1: Arrow Electronics; Manufacturer 1: Bourns; Manufacturer Part Number 1: CR0805-JW-103ELF; RoHS: Yes; Category: Chip SMD Resistors; Stock 1: 57566; Pricing 1: 1=0,05790, 10=0,01540, 25=0,01340, 100=0,00340 (USD); Mount: Surface Mount; Case/Package: 0805; Number of Pins: 2; Contact Plating: Tin; Case Code (Metric): 2012; Case Code (Imperial): 0805; Min Operating Temperature: -55°C; Max Operating Temperature: 155°C; Tolerance: 5%; Resistor Type: Thick Film; Package Quantity: 1; Packaging: Tape and Reel; Number of Terminations: 2; Termination: SMD/SMT; Max Power Dissipation: 125mW; Features: Moisture Resistant; Series: CR0805; Construction: Rectangular; Resistance Tolerance: 5%; Technology: THICK FILM; Length: 2mm; Width: 1.25mm; Height: 0.5mm; Depth: 1.25mm; Thickness: 508um; Radiation Hardening: No; REACH SVHC: No SVHC; Military Standard: Not; RoHS Compliant: Yes; ComponentLink1URL: https://datasheet.ciiva.com/11821/0900766b80fcdb72-11821135.pdf?src-supplier=RSComponents; ComponentLink1Description: https://datasheet.ciiva.com/11821/0900766b80fcdb72-11821135.pdf?src-supplier=RSComponents; ComponentLink2URL: https://datasheet.ciiva.com/9122/chpreztr-9122374.pdf?src-supplier=Avnet; ComponentLink2Description: https://datasheet.ciiva.com/9122/chpreztr-9122374.pdf?src-supplier=Avnet; ComponentLink3URL: https://datasheet.ciiva.com/22693/1902866-22693254.pdf?src-supplier=Element14; ComponentLink3Description: https://datasheet.ciiva.com/22693/1902866-22693254.pdf?src-supplier=Element14; ComponentLink4URL: https://datasheet.ciiva.com/7986/691949-7986187.pdf?src-supplier=Element14; ComponentLink4Description: https://datasheet.ciiva.com/7986/691949-7986187.pdf?src-supplier=Element14; ComponentLink5URL: https://datasheet.ciiva.com/30065/159chpreztr-30065976.pdf?src-supplier=Onlinecomponents.com; ComponentLink5Description: https://datasheet.ciiva.com/30065/159chpreztr-30065976.pdf?src-supplier=Onlinecomponents.com; ComponentLink6URL: https://datasheet.ciiva.com/16783/70154685-16783482.pdf?src-supplier=Allied+Electronics; ComponentLink6Description: https://datasheet.ciiva.com/16783/70154685-16783482.pdf?src-supplier=Allied+Electronics; ComponentLink7URL: https://datasheet.ciiva.com/5548/chpreztr-5548491.pdf?src-supplier=Mouser; ComponentLink7Description: https://datasheet.ciiva.com/5548/chpreztr-5548491.pdf?src-supplier=Mouser; ComponentLink8URL: https://datasheet.ciiva.com/6559/chpreztr-6559900.pdf?src-supplier=Digi-Key; ComponentLink8Description: https://datasheet.ciiva.com/6559/chpreztr-6559900.pdf?src-supplier=Digi-Key; ComponentLink9URL: https://datasheet.ciiva.com/6559/chpreztr-6559901.pdf?src-supplier=Digi-Key; ComponentLink9Description: https://datasheet.ciiva.com/6559/chpreztr-6559901.pdf?src-supplier=Digi-Key; ComponentLink10URL: https://datasheet.ciiva.com/7985/1856384-7985869.pdf?src-supplier=Element14; ComponentLink10Description: https://datasheet.ciiva.com/7985/1856384-7985869.pdf?src-supplier=Element14; ComponentLink11URL: https://datasheet.ciiva.com/48692/001055517-da-01-en-smd-wid-cr0805-jw-103elf-10k-ohm-1-8w-48692118.pdf?src-supplier=Conrad; ComponentLink11Description: https://datasheet.ciiva.com/48692/001055517-da-01-en-smd-wid-cr0805-jw-103elf-10k-ohm-1-8w-48692118.pdf?src-supplier=Conrad; Supplier Part Number 1: CR0805-JW-103ELF

## Sheet [3] Gate_Drivers.SchDoc
size A4; SheetNumber: 4; SheetTotal: 5
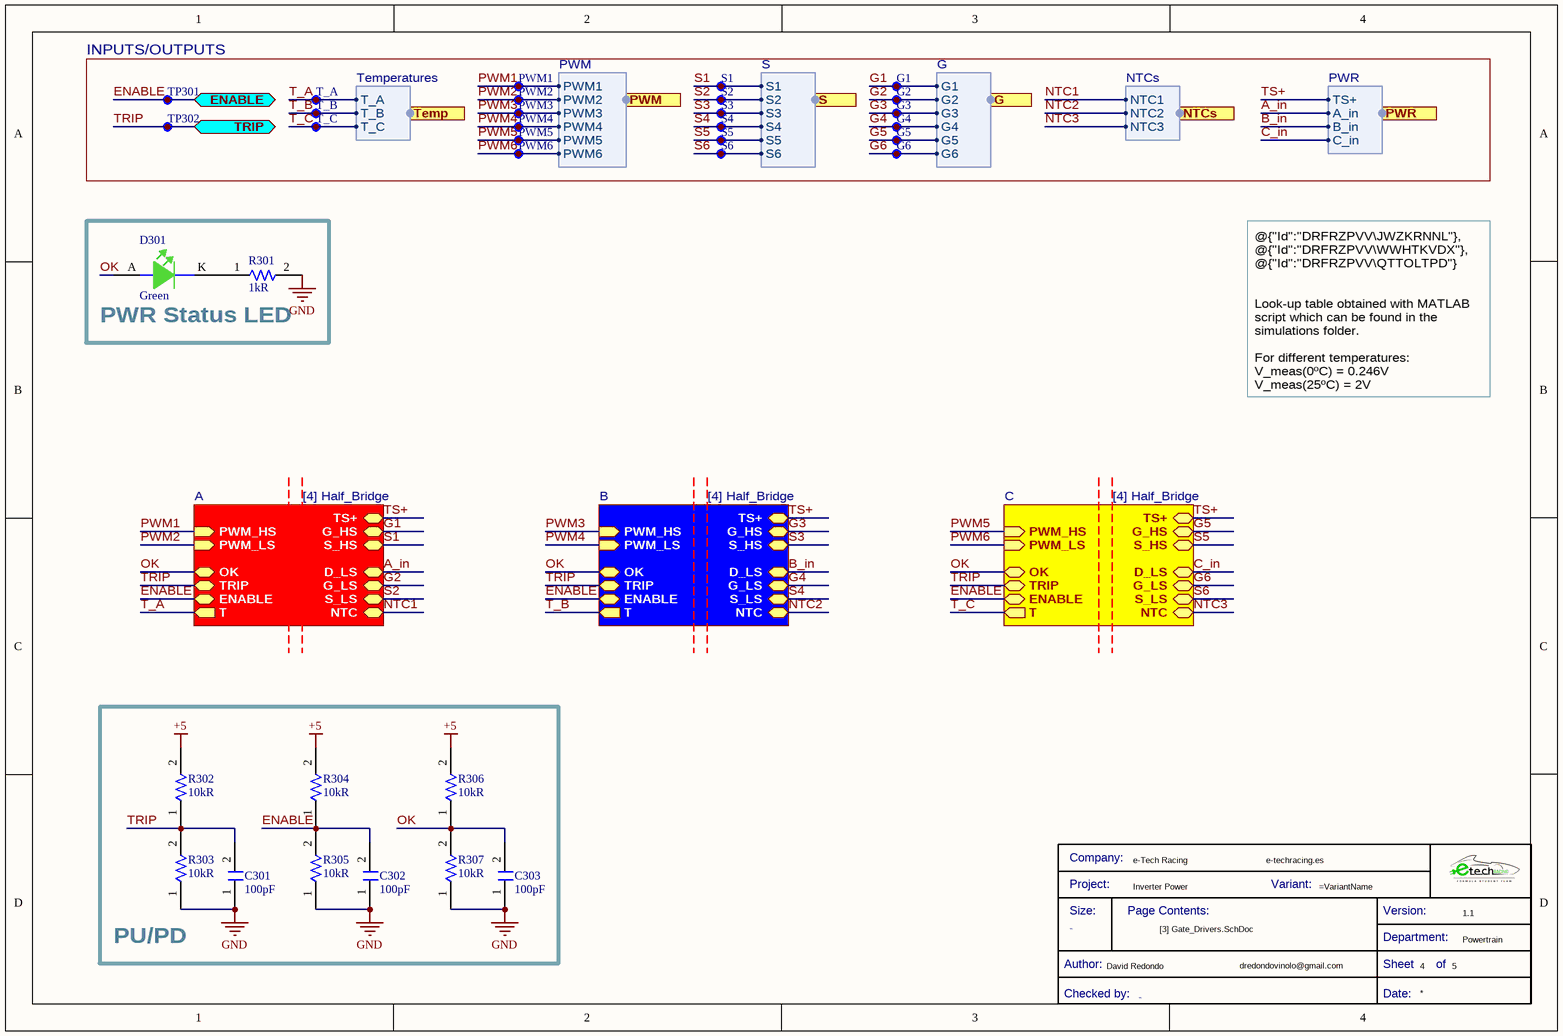
[diagram p3: [3] Gate_Drivers.SchDoc]

### Parts
(Parts that share a designator on the sheet are numbered #1, #2 ... from top to bottom, then left to right.)
*?#3  Title Block_template  (value not drawn)  (graphical)
C301  Capacitance: 100pF  [C0805FNPC-W]  (hidden comment: 885012007057)
C302  Capacitance: 100pF  [C0805FNPC-W]  (hidden comment: 885012007057)
C303  Capacitance: 100pF  [C0805FNPC-W]  (hidden comment: 885012007057)
D301  Color: Green  [LED_0805_WE]  (hidden comment: 150080GS75000)
G1  TestPoint  [TestPoint]  (value not drawn)  (no BOM)
G2  TestPoint  [TestPoint]  (value not drawn)  (no BOM)
G3  TestPoint  [TestPoint]  (value not drawn)  (no BOM)
G4  TestPoint  [TestPoint]  (value not drawn)  (no BOM)
G5  TestPoint  [TestPoint]  (value not drawn)  (no BOM)
G6  TestPoint  [TestPoint]  (value not drawn)  (no BOM)
PWM1  TestPoint  [TestPoint]  (value not drawn)  (no BOM)
PWM2  TestPoint  [TestPoint]  (value not drawn)  (no BOM)
PWM3  TestPoint  [TestPoint]  (value not drawn)  (no BOM)
PWM4  TestPoint  [TestPoint]  (value not drawn)  (no BOM)
PWM5  TestPoint  [TestPoint]  (value not drawn)  (no BOM)
PWM6  TestPoint  [TestPoint]  (value not drawn)  (no BOM)
R301  Resistance: 1kR  [R0805FTK]  (hidden comment: CR0805-JW-102ELF)
R302  Resistance: 10kR  [R0805FTK]  (hidden comment: CR0805-JW-103ELF)
R303  Resistance: 10kR  [R0805FTK]  (hidden comment: CR0805-JW-103ELF)
R304  Resistance: 10kR  [R0805FTK]  (hidden comment: CR0805-JW-103ELF)
R305  Resistance: 10kR  [R0805FTK]  (hidden comment: CR0805-JW-103ELF)
R306  Resistance: 10kR  [R0805FTK]  (hidden comment: CR0805-JW-103ELF)
R307  Resistance: 10kR  [R0805FTK]  (hidden comment: CR0805-JW-103ELF)
S1  TestPoint  [TestPoint]  (value not drawn)  (no BOM)
S2  TestPoint  [TestPoint]  (value not drawn)  (no BOM)
S3  TestPoint  [TestPoint]  (value not drawn)  (no BOM)
S4  TestPoint  [TestPoint]  (value not drawn)  (no BOM)
S5  TestPoint  [TestPoint]  (value not drawn)  (no BOM)
S6  TestPoint  [TestPoint]  (value not drawn)  (no BOM)
T_A  TestPoint  [TestPoint]  (value not drawn)  (no BOM)
T_B  TestPoint  [TestPoint]  (value not drawn)  (no BOM)
T_C  TestPoint  [TestPoint]  (value not drawn)  (no BOM)
TP301  TestPoint  [TestPoint]  (value not drawn)  (no BOM)
TP302  TestPoint  [TestPoint]  (value not drawn)  (no BOM)

### Blocks framed on the sheet
INPUTS/OUTPUTS: G1-G6 PWM1-PWM6 S1-S6 T_A T_B T_C TP301 TP302
PWR Status LED: D301 R301
PU/PD: C301-C303 R302-R307

### Sub-sheets
A = [4] Half_Bridge: PWM_HS (in), G_HS (bidir), S_HS (bidir), PWM_LS (in), G_LS (bidir), S_LS (bidir), NTC (bidir), OK (bidir), TRIP (bidir), ENABLE (bidir), T (out), D_LS (bidir), TS+ (bidir)
B = [4] Half_Bridge: PWM_HS (in), G_HS (bidir), S_HS (bidir), PWM_LS (in), G_LS (bidir), S_LS (bidir), NTC (bidir), OK (bidir), TRIP (bidir), ENABLE (bidir), T (out), TS+ (bidir), D_LS (bidir)
C = [4] Half_Bridge: PWM_HS (in), G_HS (bidir), S_HS (bidir), PWM_LS (in), G_LS (bidir), S_LS (bidir), NTC (bidir), OK (bidir), TRIP (bidir), ENABLE (bidir), T (out), TS+ (bidir), D_LS (bidir)

### Ports
ENABLE (bidir, see Inverter_Power[2C], [4] Half_Bridge[1B]), G (harness G, see Inverter_Power[3C], [1] Power_Stage[1C]), NTCs (harness NTCs, see Inverter_Power[3C], [1] Power_Stage[1B]), PWM (harness PWM, see Inverter_Power[2C]), PWR (harness PWR, see Inverter_Power[3B]), S (harness S, see Inverter_Power[3C], [1] Power_Stage[1C]), Temp (harness Temperatures, see Inverter_Power[2C]), TRIP (bidir, see Inverter_Power[2C], [4] Half_Bridge[1B])

### Harnesses
PWM: PWM1, PWM2, PWM3, PWM4, PWM5, PWM6
S: S1, S2, S3, S4, S5, S6
G: G1, G2, G3, G4, G5, G6
NTCs: NTC1, NTC2, NTC3
Temperatures: T_A, T_B, T_C
PWR: TS+, A_in, B_in, C_in

### Nets
+5: R302.2 R304.2 R306.2
A_in: sheet A/D_LS, port PWR.A_in
B_in: sheet B/D_LS, port PWR.B_in
C_in: sheet C/D_LS, port PWR.C_in
GND: C301.1 C302.1 C303.1 R301.2 R303.1 R305.1 R307.1
TS+: sheet A/TS+, sheet B/TS+, sheet C/TS+, port PWR.TS+
ENABLE: C302.2 R304.1 R305.2 TP301.1(TP) ; port ENABLE, sheet A/ENABLE, sheet B/ENABLE, sheet C/ENABLE
G1: G1.1(TP) ; sheet A/G_HS, port G.G1
G2: G2.1(TP) ; sheet A/G_LS, port G.G2
G3: G3.1(TP) ; sheet B/G_HS, port G.G3
G4: G4.1(TP) ; sheet B/G_LS, port G.G4
G5: G5.1(TP) ; sheet C/G_HS, port G.G5
G6: G6.1(TP) ; sheet C/G_LS, port G.G6
NTC1: sheet A/NTC, port NTCs.NTC1
NTC2: sheet B/NTC, port NTCs.NTC2
NTC3: sheet C/NTC, port NTCs.NTC3
OK: C303.2 D301.A R306.1 R307.2 ; sheet A/OK, sheet B/OK, sheet C/OK
PWM1: PWM1.1(TP) ; sheet A/PWM_HS, port PWM.PWM1
PWM2: PWM2.1(TP) ; sheet A/PWM_LS, port PWM.PWM2
PWM3: PWM3.1(TP) ; sheet B/PWM_HS, port PWM.PWM3
PWM4: PWM4.1(TP) ; sheet B/PWM_LS, port PWM.PWM4
PWM5: PWM5.1(TP) ; sheet C/PWM_HS, port PWM.PWM5
PWM6: PWM6.1(TP) ; sheet C/PWM_LS, port PWM.PWM6
S1: S1.1(TP) ; sheet A/S_HS, port S.S1
S2: S2.1(TP) ; sheet A/S_LS, port S.S2
S3: S3.1(TP) ; sheet B/S_HS, port S.S3
S4: S4.1(TP) ; sheet B/S_LS, port S.S4
S5: S5.1(TP) ; sheet C/S_HS, port S.S5
S6: S6.1(TP) ; sheet C/S_LS, port S.S6
T_A: T_A.1(TP) ; sheet A/T, port Temp.T_A
T_B: T_B.1(TP) ; sheet B/T, port Temp.T_B
T_C: T_C.1(TP) ; sheet C/T, port Temp.T_C
TRIP: C301.2 R302.1 R303.2 TP302.1(TP) ; port TRIP, sheet A/TRIP, sheet B/TRIP, sheet C/TRIP
NetD301_K: D301.K R301.1

### Notes on the sheet
- @{"Id":"DRFRZPVV\JWZKRNNL"}, @{"Id":"DRFRZPVV\WWHTKVDX"}, @{"Id":"DRFRZPVV\QTTOLTPD"}
  Look-up table obtained with MATLAB script which can be found in the simulations folder.
  For different temperatures:
  V_meas(0ºC) = 0.246V
  V_meas(25ºC) = 2V
  V_meas(50ºC) = 2.578V
  V_meas(90ºC) = 2.864V
- (in symbol Title Block_template) Company:; Project:; Variant:; Size:; Page Contents:; Version:; Department:; Author:; Sheet; of; Checked by:; Date:

### Library data of the parts
*?#3 = Title Block_template: Standard Title Block; .Creator: GP; Category: Title Block; .PCBcheck: GP; .SCHcheck: GP; Checked by:: -; Size: -
C301-C303 = C100p-50V-0805FNPC-C0G/NP0: Multilayer Ceramic Capacitor, Wcap-Csgp Series, 100 Pf, 5%, C0G / Np0, 50 V, 0805 [2012 Metric] Rohs Compliant: Yes; Manufacturer: Wurth Electronics; Voltage Rating: 50V; .Creator: DR; Supplier 1: RSComponents; Manufacturer Part Number: 885012007057; RoHS: Yes; Category: Ceramic Capacitors; Stock 1: 1; Pricing 1: 4000=0,03900, 12000=0,03800 (USD); Mount: Surface Mount; Case/Package: 0805; Case Code (Metric): 2012; Case Code (Imperial): 0805; Min Operating Temperature: -55°C; Max Operating Temperature: 125°C; Packaging: Cut Tape; Dielectric: C0G; Tolerance: 5%; Voltage Rating (DC): 50V; Length: 0.079inch; Width: 0.049inch; Thickness: 0.035inch; REACH SVHC: Unknown; RoHS Compliant: Yes; ComponentLink1URL: http://www.farnell.com/datasheets/1958443.pdf?src-supplier=Farnell; ComponentLink1Description: http://www.farnell.com/datasheets/1958443.pdf?src-supplier=Farnell; ComponentLink2URL: https://katalog.we-online.de/pbs/datasheet/885012007057.pdf?src-supplier=Digi-Key; ComponentLink2Description: https://katalog.we-online.de/pbs/datasheet/885012007057.pdf?src-supplier=Digi-Key; ComponentLink3URL: http://www.farnell.com/datasheets/1958443.pdf?src-supplier=Element14; ComponentLink3Description: http://www.farnell.com/datasheets/1958443.pdf?src-supplier=Element14; ComponentLink4URL: http://www.farnell.com/datasheets/1958443.pdf?src-supplier=Newark; ComponentLink4Description: http://www.farnell.com/datasheets/1958443.pdf?src-supplier=Newark; ComponentLink5Description: Where buy it; ComponentLink5URL: https://www.we-online.com/catalog/en/WCAP-CSGP-50VDC#885012007057; Supplier Part Number 1: 1813930
D301 = LEDGS-0805-450: Led, Green, 520 Nm, 3.2 V, 30 Ma, 450 Mcd Rohs Compliant: Yes; Manufacturer 1: Wurth Electronics; Viewing Angle: 140°; Lens Style: Clear,Rectangular; Luminous Intensity: 450mcd; Forward Voltage: 3.2V; Wavelength: 520nm; Forward Current: 30mA; Test Current: 20mA; .Creator: GP; ComponentLink1Description: Datasheet; ComponentLink1URL: https://www.we-online.com/catalog/datasheet/150080GS75000.pdf; ComponentLink2Description: Where buy it; ComponentLink2URL: https://katalog.we-online.de/en/led/WL-SMCW/150080GS75000; Supplier 1: RSComponents; Manufacturer Part Number 1: 150080GS75000; RoHS: Yes; Category: LEDs; Stock 1: 4350; Pricing 1: 50=0,19300, 500=0,12900, 1000=0,12300, 2000=0,11700, 4000=0,11100 (USD); Mount: Surface Mount; Case/Package: 0805; Case Code (Metric): 2012; Case Code (Imperial): 0805; Min Operating Temperature: -40°C; Max Operating Temperature: 85°C; Package Quantity: 4000; Packaging: Cut Tape; Dominant Wavelength: 520nm; Length: 2mm; Width: 1.25mm; Height: 0.7mm; REACH SVHC: Unknown; RoHS Compliant: Yes; ComponentLink3URL: https://datasheet.ciiva.com/29563/150080gs75000-29563008.pdf?src-supplier=Digi-Key; ComponentLink3Description: https://datasheet.ciiva.com/29563/150080gs75000-29563008.pdf?src-supplier=Digi-Key; ComponentLink4URL: https://datasheet.ciiva.com/29279/759434-da-01-en-chipled-0805-w-kl-gruen-150080gs75000-29279039.pdf?src-supplier=Conrad; ComponentLink4Description: https://datasheet.ciiva.com/29279/759434-da-01-en-chipled-0805-w-kl-gruen-150080gs75000-29279039.pdf?src-supplier=Conrad; Supplier Part Number 1: 8154221
G1-G6 PWM1-PWM6 S1-S6 T_A T_B T_C TP301 TP302 = TestPoint: Test Point 1x1 mm; .Creator: GP; Category: TestPoint; .PCBcheck: GP; .SCHcheck: GP
R301 = R1k-0805FTK: Res Thick Film 0805 1K Ohm 5% 1/8W ±200ppm/°C Molded SMD SMD Paper Tape on Plastic Reel; Manufacturer 1: Bourns; Voltage Rating (DC): 150V; Power Rating: 125mW; .Creator: GP; Supplier 1: Arrow Electronics; Manufacturer Part Number 1: CR0805-JW-102ELF; RoHS: Yes; Category: Chip SMD Resistors; Stock 1: 27510; Pricing 1: 1=0,05930, 10=0,03510, 25=0,01790, 100=0,00800, 250=0,00790, 500=0,00590, 1000=0,00360, 3000=0,00350, 6000=0,00250 (USD); Mount: Surface Mount; Case/Package: 0805; Number of Pins: 2; Contact Plating: Tin; Case Code (Metric): 2012; Case Code (Imperial): 0805; Min Operating Temperature: -55°C; Max Operating Temperature: 155°C; Resistor Type: Thick Film; Tolerance: 5%; Temperature Coefficient: 200ppm/°C; Features: Moisture Resistant; Package Quantity: 1; Packaging: Tape and Reel; Voltage Rating: 150V; Number of Terminations: 2; Termination: SMD/SMT; Max Power Dissipation: 125mW; Length: 2mm; Width: 1.25mm; Height: 0.5mm; Thickness: 508um; Depth: 1.25mm; Radiation Hardening: No; Lead Free: Lead Free; REACH SVHC: No SVHC; Military Standard: Not; ComponentLink1URL: https://datasheet.ciiva.com/11821/0900766b80fcdb72-11821134.pdf?src-supplier=RSComponents; ComponentLink1Description: https://datasheet.ciiva.com/11821/0900766b80fcdb72-11821134.pdf?src-supplier=RSComponents; ComponentLink2URL: https://datasheet.ciiva.com/15225/getdatasheetpartid-78155-15225381.pdf?src-supplier=Verical; ComponentLink2Description: https://datasheet.ciiva.com/15225/getdatasheetpartid-78155-15225381.pdf?src-supplier=Verical; ComponentLink3URL: https://datasheet.ciiva.com/22693/1902866-22693253.pdf?src-supplier=Element14; ComponentLink3Description: https://datasheet.ciiva.com/22693/1902866-22693253.pdf?src-supplier=Element14; ComponentLink4URL: https://datasheet.ciiva.com/7986/1856384-7986184.pdf?src-supplier=Element14; ComponentLink4Description: https://datasheet.ciiva.com/7986/1856384-7986184.pdf?src-supplier=Element14; ComponentLink5URL: https://datasheet.ciiva.com/7985/1856384-7985867.pdf?src-supplier=Element14; ComponentLink5Description: https://datasheet.ciiva.com/7985/1856384-7985867.pdf?src-supplier=Element14; ComponentLink6URL: https://datasheet.ciiva.com/30242/159chpreztr-30242765.pdf?src-supplier=Onlinecomponents.com; ComponentLink6Description: https://datasheet.ciiva.com/30242/159chpreztr-30242765.pdf?src-supplier=Onlinecomponents.com; ComponentLink7URL: https://datasheet.ciiva.com/6547/chpreztr-6547359.pdf?src-supplier=Digi-Key; ComponentLink7Description: https://datasheet.ciiva.com/6547/chpreztr-6547359.pdf?src-supplier=Digi-Key; Supplier Part Number 1: CR0805-JW-102ELF
R302-R307 = R10k-0805FTK: as R201 on sheet [2] Current_Sense; Supplier 1: Arrow Electronics; Manufacturer 1: Bourns; Manufacturer Part Number 1: CR0805-JW-103ELF; RoHS: Yes; Category: Chip SMD Resistors; Stock 1: 57566; Pricing 1: 1=0,05790, 10=0,01540, 25=0,01340, 100=0,00340 (USD); Mount: Surface Mount; Case/Package: 0805; Number of Pins: 2; Contact Plating: Tin; Case Code (Metric): 2012; Case Code (Imperial): 0805; Min Operating Temperature: -55°C; Max Operating Temperature: 155°C; Tolerance: 5%; Resistor Type: Thick Film; Package Quantity: 1; Packaging: Tape and Reel; Number of Terminations: 2; Termination: SMD/SMT; Max Power Dissipation: 125mW; Features: Moisture Resistant; Series: CR0805; Construction: Rectangular; Resistance Tolerance: 5%; Technology: THICK FILM; Length: 2mm; Width: 1.25mm; Height: 0.5mm; Depth: 1.25mm; Thickness: 508um; Radiation Hardening: No; REACH SVHC: No SVHC; Military Standard: Not; RoHS Compliant: Yes; ComponentLink1URL: https://datasheet.ciiva.com/11821/0900766b80fcdb72-11821135.pdf?src-supplier=RSComponents; ComponentLink1Description: https://datasheet.ciiva.com/11821/0900766b80fcdb72-11821135.pdf?src-supplier=RSComponents; ComponentLink2URL: https://datasheet.ciiva.com/9122/chpreztr-9122374.pdf?src-supplier=Avnet; ComponentLink2Description: https://datasheet.ciiva.com/9122/chpreztr-9122374.pdf?src-supplier=Avnet; ComponentLink3URL: https://datasheet.ciiva.com/22693/1902866-22693254.pdf?src-supplier=Element14; ComponentLink3Description: https://datasheet.ciiva.com/22693/1902866-22693254.pdf?src-supplier=Element14; ComponentLink4URL: https://datasheet.ciiva.com/7986/691949-7986187.pdf?src-supplier=Element14; ComponentLink4Description: https://datasheet.ciiva.com/7986/691949-7986187.pdf?src-supplier=Element14; ComponentLink5URL: https://datasheet.ciiva.com/30065/159chpreztr-30065976.pdf?src-supplier=Onlinecomponents.com; ComponentLink5Description: https://datasheet.ciiva.com/30065/159chpreztr-30065976.pdf?src-supplier=Onlinecomponents.com; ComponentLink6URL: https://datasheet.ciiva.com/16783/70154685-16783482.pdf?src-supplier=Allied+Electronics; ComponentLink6Description: https://datasheet.ciiva.com/16783/70154685-16783482.pdf?src-supplier=Allied+Electronics; ComponentLink7URL: https://datasheet.ciiva.com/5548/chpreztr-5548491.pdf?src-supplier=Mouser; ComponentLink7Description: https://datasheet.ciiva.com/5548/chpreztr-5548491.pdf?src-supplier=Mouser; ComponentLink8URL: https://datasheet.ciiva.com/6559/chpreztr-6559900.pdf?src-supplier=Digi-Key; ComponentLink8Description: https://datasheet.ciiva.com/6559/chpreztr-6559900.pdf?src-supplier=Digi-Key; ComponentLink9URL: https://datasheet.ciiva.com/6559/chpreztr-6559901.pdf?src-supplier=Digi-Key; ComponentLink9Description: https://datasheet.ciiva.com/6559/chpreztr-6559901.pdf?src-supplier=Digi-Key; ComponentLink10URL: https://datasheet.ciiva.com/7985/1856384-7985869.pdf?src-supplier=Element14; ComponentLink10Description: https://datasheet.ciiva.com/7985/1856384-7985869.pdf?src-supplier=Element14; ComponentLink11URL: https://datasheet.ciiva.com/48692/001055517-da-01-en-smd-wid-cr0805-jw-103elf-10k-ohm-1-8w-48692118.pdf?src-supplier=Conrad; ComponentLink11Description: https://datasheet.ciiva.com/48692/001055517-da-01-en-smd-wid-cr0805-jw-103elf-10k-ohm-1-8w-48692118.pdf?src-supplier=Conrad; Supplier Part Number 1: CR0805-JW-103ELF